# Altium schematic sheet Circuit Schematics_26064.SchDoc
size A3; SheetNumber: 5; SheetTotal: 5
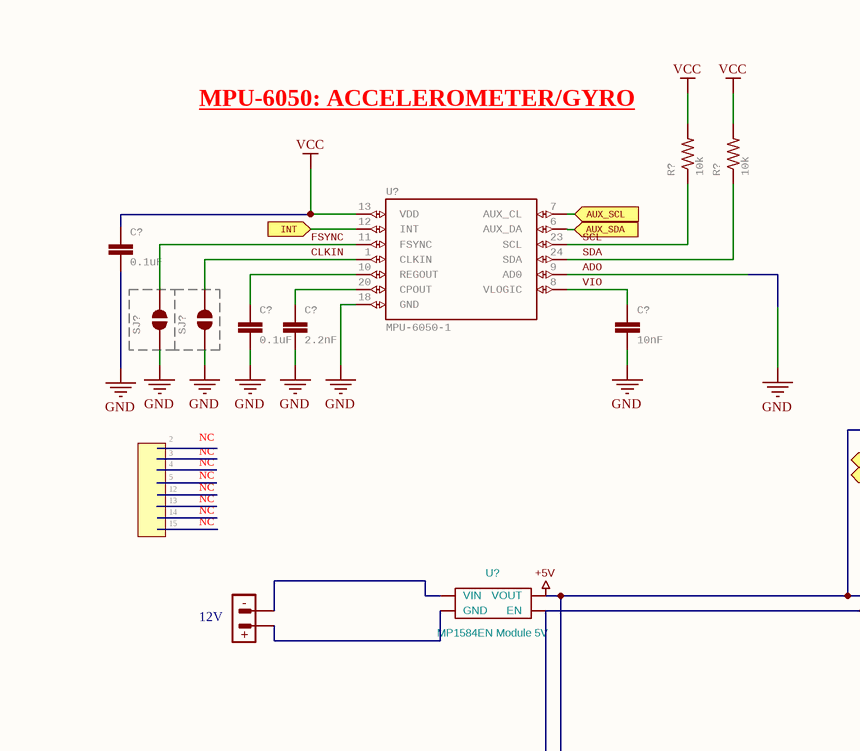
[diagram p0: Circuit Schematics_26064.SchDoc, top left]
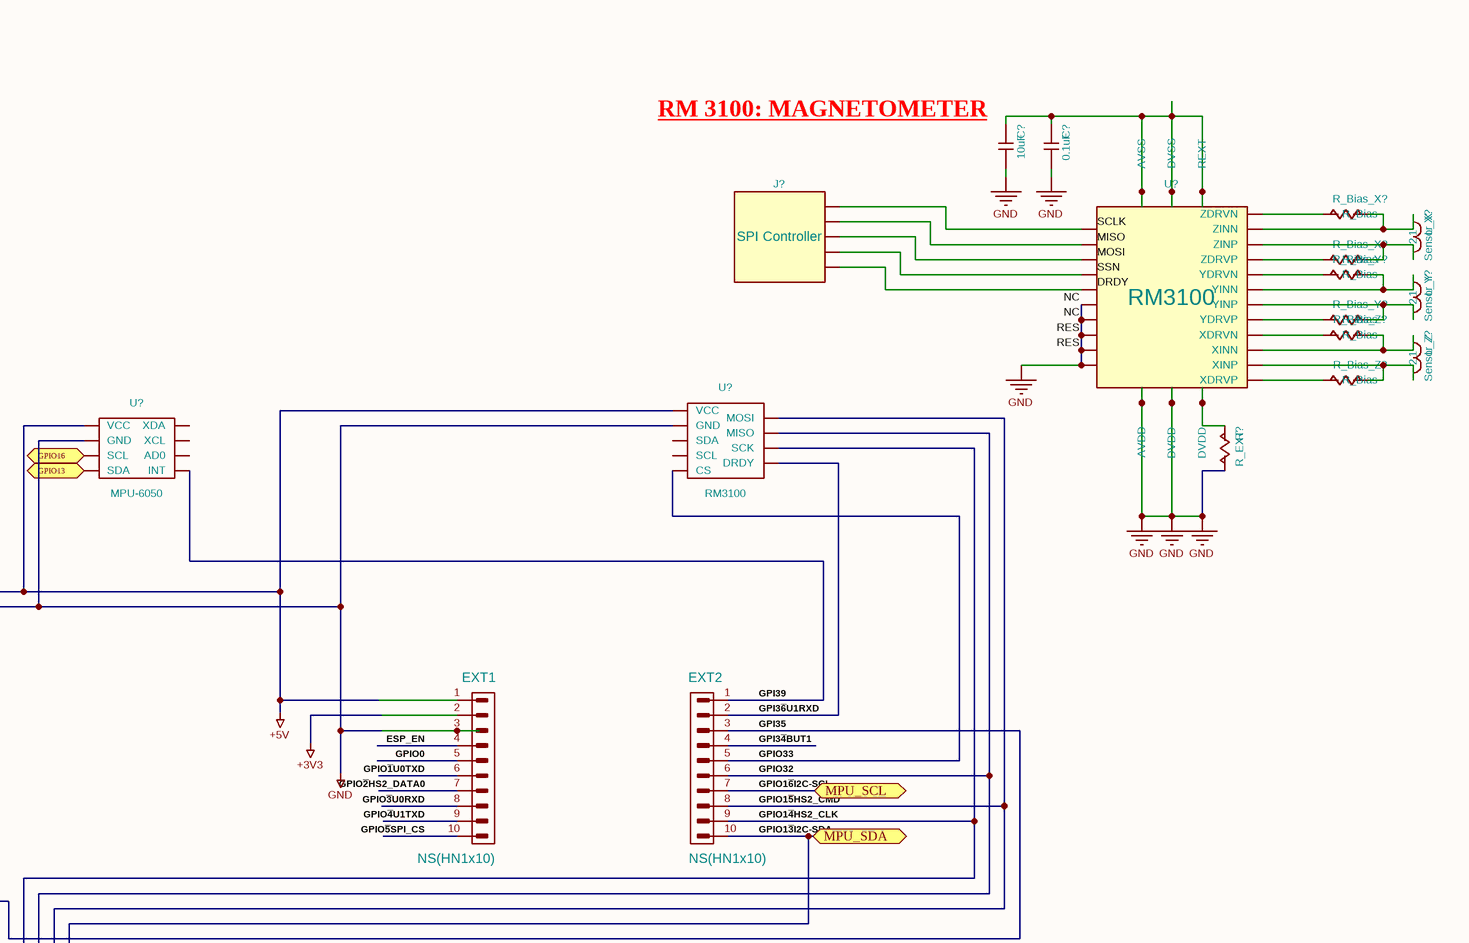
[diagram p1: Circuit Schematics_26064.SchDoc, top right]
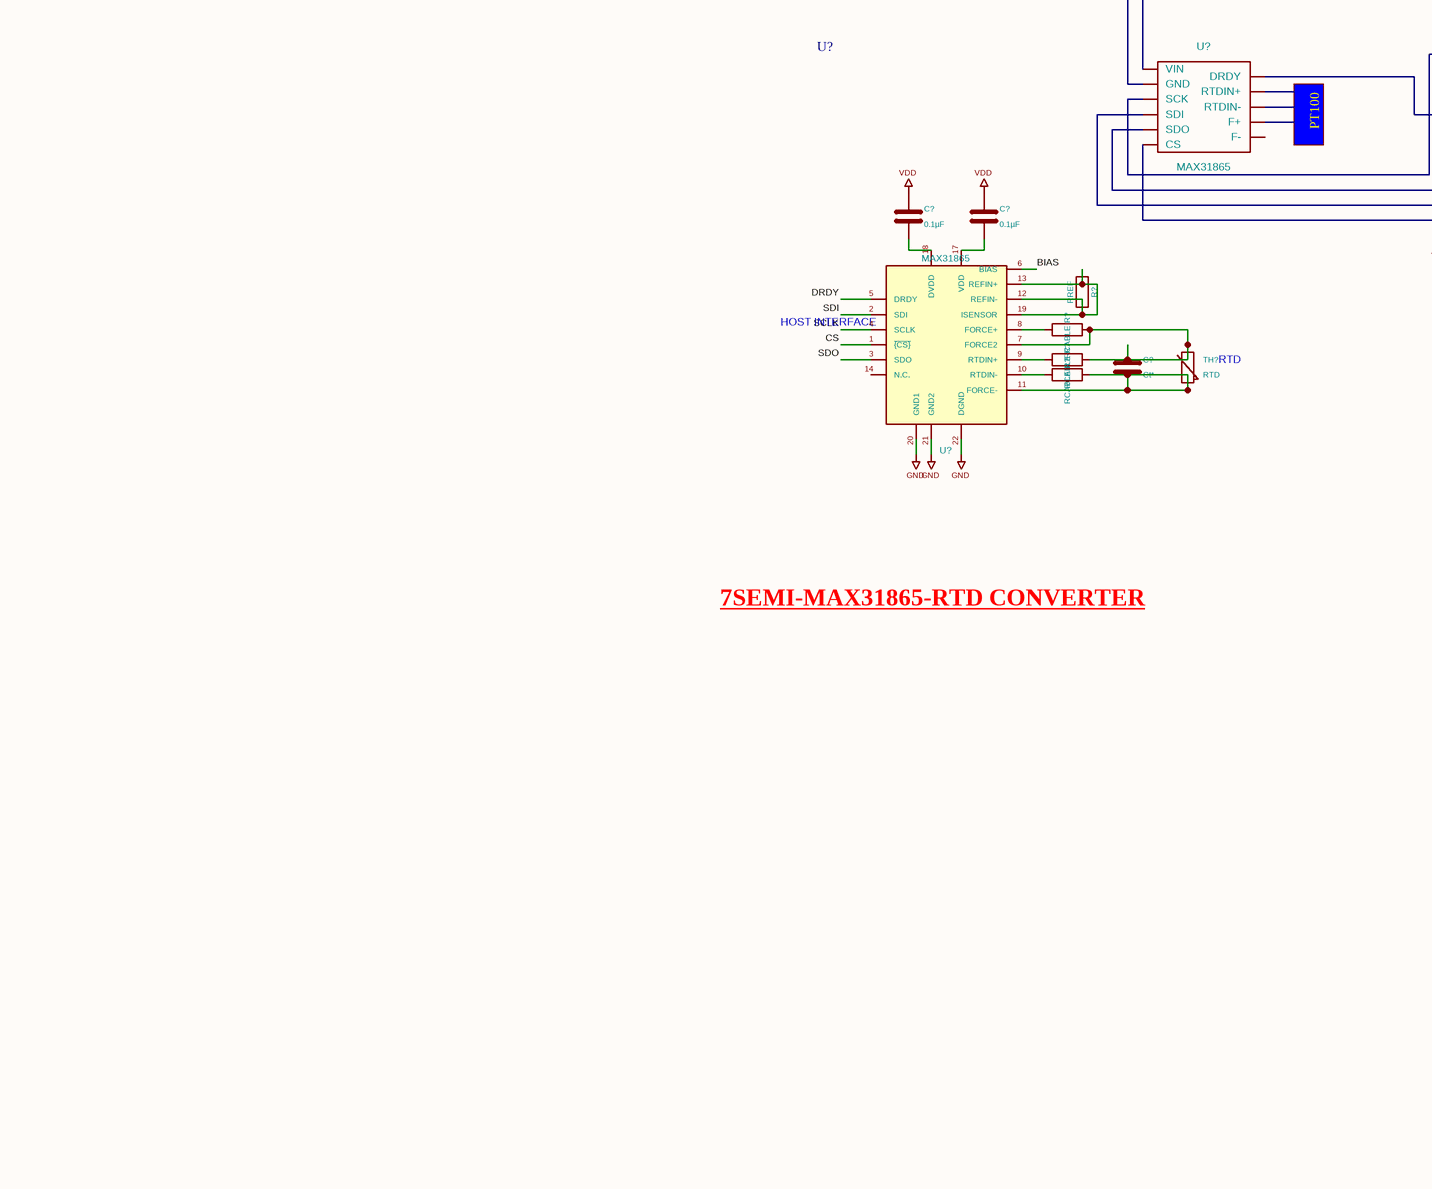
[diagram p2: Circuit Schematics_26064.SchDoc, bottom left]
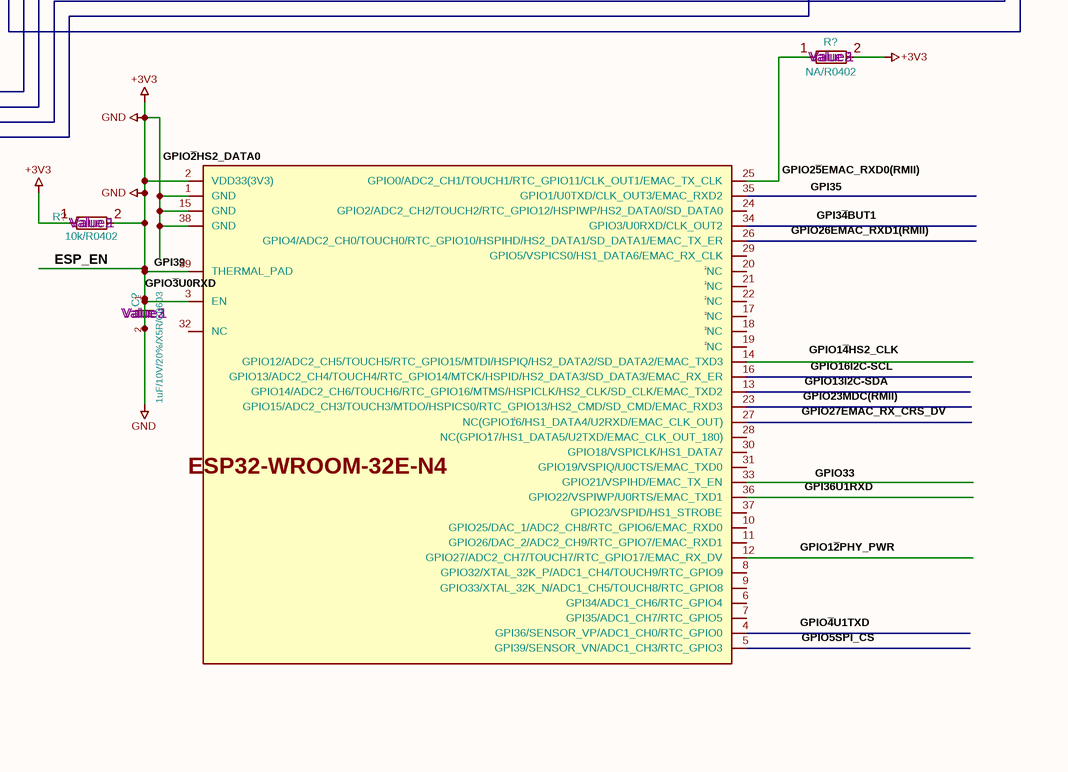
[diagram p3: Circuit Schematics_26064.SchDoc, bottom right]

## Parts
(Parts that share a designator on the sheet are numbered #1, #2 ... from top to bottom, then left to right.)
?  ESP32-WROVER(WROOM)-UNIVERSAL  (value not drawn)
C?#1  10uF
C?#2  0.1uF
C?#3  0.1uF  [0603-CAP]
C?#4  0.1uF  [0603-CAP]
C?#5  2.2nF  [0603-CAP]
C?#6  10nF  [0603-CAP]
C?#7  0.1µF
C?#8  0.1µF
C?#9  Ct*
C?#10  Fieldname 1: Value 1  Fieldname2: Value2  Fieldname3: Value3  [C_0603_5MIL_DWS]  (hidden comment: 1uF/10V/20%/X5R/C0603)
EXT1  NS(HN1x10)  [HN1x10]
EXT2  NS(HN1x10)  [HN1x10]
J?  SPI Controller
L_X?  Sensor_X
L_Y?  Sensor_Y
L_Z?  Sensor_Z
R?#1  10k  [0603-RES]
R?#2  10k  [0603-RES]
R?#3  R_EXT
R?#4  Fieldname 1: Value 1  Fieldname2: Value2  Fieldname3: Value3  [R_0402_5MIL_DWS]  (hidden comment: NA/R0402)
R?#5  RREF
R?#6  Fieldname 1: Value 1  Fieldname2: Value2  [R_0402_5MIL_DWS]  (hidden comment: 10k/R0402)
R?#7  RCABLE
R?#8  RCABLE
R?#9  RCABLE
R_Bias_X?#1  R_Bias
R_Bias_X?#2  R_Bias
R_Bias_Y?#1  R_Bias
R_Bias_Y?#2  R_Bias
R_Bias_Z?#1  R_Bias
R_Bias_Z?#2  R_Bias
SJ?#1  SOLDERJUMPERTRACE  [SJ_2S-TRACE]  (value not drawn)
SJ?#2  SOLDERJUMPERTRACE  [SJ_2S-TRACE]  (value not drawn)
TH?  RTD
U?#1  MPU-6050-1  [QFN-24-4MM2]
U?#2  RM3100
U?#3  RM3100
U?#4  MPU-6050
U?#5  MP1584EN Module 5V
U?#6  BAT_CON  (value not drawn)
U?#7  MAX31865
U?#8  MAX31865

## Ports
AUX_SCL (in), AUX_SDA (in), GPIO13 (bidir), GPIO16 (bidir), INT (in), MPU_SCL (bidir), MPU_SDA (bidir)

## Nets
+5V: EXT1.1 U?#3.1(VCC) U?#4.1(VCC) U?#5.3(VOUT) U?#7.1(VIN)
ADO: ?.1(GND) ?.2(VDD33(3V3)) ?.3(EN) ?.15(GND) ?.38(GND) ?.39(THERMAL_PAD) C?#1.1 C?#2.1 C?#3.2 C?#4.2 C?#5.2 C?#6.2 C?#10.1 C?#10.2 EXT1.2 EXT1.3 EXT1.4 EXT1.8 R?#3.1 R?#4.2 R?#6.1 R?#6.2 SJ?#1.1 SJ?#2.1 U?#1.9(AD0) U?#1.18(GND) U?#2.1(AVDD) U?#2.2(DVDD) U?#2.4(SCLK) U?#2.5(MISO) U?#2.6(MOSI) U?#2.7(SSN) U?#2.8(DRDY) U?#3.2(GND) U?#4.2(GND) U?#5.4(EN) U?#7.2(GND) U?#8.20(GND1) U?#8.21(GND2) U?#8.22(DGND)  [also labelled +3V3, ESP_EN, GND, GPIO~{3}U0RXD, NC, RES]
VCC: C?#3.1 R?#1.2 R?#2.2 U?#1.13(VDD)
VDD: C?#7.1 C?#8.1
AUX_SCL: U?#1.7(AUX_CL) ; port AUX_SCL
AUX_SDA: U?#1.6(AUX_DA) ; port AUX_SDA
BIAS: U?#8.6(BIAS)
CLKIN: SJ?#2.2 U?#1.1(CLKIN)
CS: U?#8.1(~{{CS}})
DRDY: U?#8.5(DRDY)
FSYNC: SJ?#1.2 U?#1.11(FSYNC)
GPI3~{4}BUT1: EXT2.4
GPI35: EXT2.3 U?#7.7(DRDY)
GPI3~{6}U1RXD: EXT2.2 U?#3.9(DRDY)
GPI39: EXT2.1 U?#4.8(INT)
GPIO0: EXT1.5
GPIO~{1}U0TXD: EXT1.6
GPIO~{2}HS2_DATA0: EXT1.7
GPIO~{4}U1TXD: EXT1.9
GPIO~{5}SPI_CS: EXT1.10
GPIO13: U?#4.4(SDA) ; port GPIO13
GPIO1~{3}I2C-SDA: EXT2.10 U?#7.6(CS) ; port MPU_SDA
GPIO1~{4}HS2_CLK: EXT2.9 U?#3.8(SCK) U?#7.3(SCK)
GPIO1~{5}HS2_CMD: EXT2.8 U?#3.6(MOSI) U?#7.4(SDI)
GPIO16: U?#4.3(SCL) ; port GPIO16
GPIO1~{6}I2C-SCL: EXT2.7 ; port MPU_SCL
GPIO32: EXT2.6 U?#3.7(MISO) U?#7.5(SDO)
GPIO33: EXT2.5 U?#3.5(CS)
INT: U?#1.12(INT) ; port INT
SCL: R?#1.1 U?#1.23(SCL)
SCLK: U?#8.4(SCLK)
SDA: R?#2.1 U?#1.24(SDA)
SDI: U?#8.2(SDI)
SDO: U?#8.3(SDO)
VIO: C?#6.1 U?#1.8(VLOGIC)
Net?_25: ?.25(GPIO0/ADC2_CH1/TOUCH1/RTC_GPIO11/CLK_OUT1/EMAC_TX_CLK) R?#4.1
NetC?#1_2: C?#1.2 C?#2.2 U?#2.14(AVSS) U?#2.15(DVSS) U?#2.16(REXT)
NetC?#4_1: C?#4.1 U?#1.10(REGOUT)
NetC?#5_1: C?#5.1 U?#1.20(CPOUT)
NetC?#7_2: C?#7.2 U?#8.18(DVDD)
NetC?#8_2: C?#8.2 U?#8.17(VDD)
NetC?#9_1: C?#9.1 R?#7.2 R?#8.2 TH?.1 U?#8.7(FORCE2)
NetC?#9_2: C?#9.2 R?#9.2 TH?.2 U?#8.11(FORCE-)
NetJ?_1: J?.1(SCLK) U?#2.9(NC)
NetJ?_2: J?.2(MISO) U?#2.10(NC)
NetJ?_3: J?.3(MOSI) U?#2.11(RES)
NetJ?_4: J?.4(SSN/CS) U?#2.12(RES)
NetJ?_5: J?.5(DRDY) U?#2.13(I2C)
NetL_X?_1: L_X?.1 R_Bias_X?#2.2 U?#2.26(ZINP)
NetL_X?_2: L_X?.2 R_Bias_X?#1.2 U?#2.27(ZINN)
NetL_Y?_1: L_Y?.1 R_Bias_Y?#2.2 U?#2.22(YINP)
NetL_Y?_2: L_Y?.2 R_Bias_Y?#1.2 U?#2.23(YINN)
NetL_Z?_1: L_Z?.1 R_Bias_Z?#2.2 U?#2.18(XINP)
NetL_Z?_2: L_Z?.2 R_Bias_Z?#1.2 U?#2.19(XINN)
NetR?#3_2: R?#3.2 U?#2.3(DVDD)
NetR?#5_1: R?#5.1 R?#5.2 U?#8.12(REFIN-) U?#8.13(REFIN+) U?#8.19(ISENSOR)
NetR?#7_1: R?#7.1 U?#8.8(FORCE+)
NetR?#8_1: R?#8.1 U?#8.9(RTDIN+)
NetR?#9_1: R?#9.1 U?#8.10(RTDIN-)
NetR_Bias_X?#1_1: R_Bias_X?#1.1 U?#2.28(ZDRVN)
NetR_Bias_X?#2_1: R_Bias_X?#2.1 U?#2.25(ZDRVP)
NetR_Bias_Y?#1_1: R_Bias_Y?#1.1 U?#2.24(YDRVN)
NetR_Bias_Y?#2_1: R_Bias_Y?#2.1 U?#2.21(YDRVP)
NetR_Bias_Z?#1_1: R_Bias_Z?#1.1 U?#2.20(XDRVN)
NetR_Bias_Z?#2_1: R_Bias_Z?#2.1 U?#2.17(XDRVP)
NetU?#5_1: U?#5.1(VIN) U?#6.2
NetU?#5_2: U?#5.2(GND) U?#6.1

Not connected (* = marked no-connect by the designer): ? 4(GPI36/SENSOR_VP/ADC1_CH0/RTC_GPIO0) 5(GPI39/SENSOR_VN/ADC1_CH3/RTC_GPIO3) 6(GPI34/ADC1_CH6/RTC_GPIO4) 7(GPI35/ADC1_CH7/RTC_GPIO5) 8(GPIO32/XTAL_32K_P/ADC1_CH4/TOUCH9/RTC_GPIO9) 9(GPIO33/XTAL_32K_N/ADC1_CH5/TOUCH8/RTC_GPIO8) 10(GPIO25/DAC_1/ADC2_CH8/RTC_GPIO6/EMAC_RXD0) 11(GPIO26/DAC_2/ADC2_CH9/RTC_GPIO7/EMAC_RXD1) 12(GPIO27/ADC2_CH7/TOUCH7/RTC_GPIO17/EMAC_RX_DV) 13(GPIO14/ADC2_CH6/TOUCH6/RTC_GPIO16/MTMS/HSPICLK/HS2_CLK/SD_CLK/EMAC_TXD2) 14(GPIO12/ADC2_CH5/TOUCH5/RTC_GPIO15/MTDI/HSPIQ/HS2_DATA2/SD_DATA2/EMAC_TXD3) 16(GPIO13/ADC2_CH4/TOUCH4/RTC_GPIO14/MTCK/HSPID/HS2_DATA3/SD_DATA3/EMAC_RX_ER) 17(NC) 18(NC) 19(NC) 20(NC) 21(NC) 22(NC) 23(GPIO15/ADC2_CH3/TOUCH3/MTDO/HSPICS0/RTC_GPIO13/HS2_CMD/SD_CMD/EMAC_RXD3) 24(GPIO2/ADC2_CH2/TOUCH2/RTC_GPIO12/HSPIWP/HS2_DATA0/SD_DATA0) 26(GPIO4/ADC2_CH0/TOUCH0/RTC_GPIO10/HSPIHD/HS2_DATA1/SD_DATA1/EMAC_TX_ER) 27(NC(GPIO16/HS1_DATA4/U2RXD/EMAC_CLK_OUT)) 28(NC(GPIO17/HS1_DATA5/U2TXD/EMAC_CLK_OUT_180)) 29(GPIO5/VSPICS0/HS1_DATA6/EMAC_RX_CLK) 30(GPIO18/VSPICLK/HS1_DATA7) 31(GPIO19/VSPIQ/U0CTS/EMAC_TXD0) 32(NC) 33(GPIO21/VSPIHD/EMAC_TX_EN) 34(GPIO3/U0RXD/CLK_OUT2) 35(GPIO1/U0TXD/CLK_OUT3/EMAC_RXD2) 36(GPIO22/VSPIWP/U0RTS/EMAC_TXD1) 37(GPIO23/VSPID/HS1_STROBE); U?#3 3(SDA) 4(SCL); U?#4 5(XDA) 6(XCL) 7(AD0); U?#7 8(RTDIN+) 9(RTDIN-) 10(F+) 11(F-); U?#8 14(N.C.)

## Notes on the sheet
- MPU-6050: ACCELEROMETER/GYRO
- RM 3100: MAGNETOMETER
- 2
- NC
- 3
- 4
- 5
- 12
- 13
- 14
- 15
- (near U?#6) 12V
- (near U?#7) PT100
- (near U?#8) HOST
  INTERFACE
- (near TH?) RTD
- 7SEMI-MAX31865-RTD CONVERTER
- Labels drawn without touching a wire or pin: DRDY, GPI3~{4}BUT1, GPI3~{6}U1RXD, GPI35, GPI39, GPIO1~{2}PHY_PWR, GPIO1~{3}I2C-SDA, GPIO1~{4}HS2_CLK, GPIO1~{6}I2C-SCL, GPIO2~{3}MDC(RMII), GPIO2~{5}EMAC_RXD0(RMII), GPIO2~{6}EMAC_RXD1(RMII), GPIO2~{7}EMAC_RX_CRS_DV, GPIO33, GPIO~{2}HS2_DATA0, GPIO~{4}U1TXD, GPIO~{5}SPI_CS, MISO, MOSI, SCLK, SSN
- (in symbol BAT_CON) -; +
- (in symbol ESP32-WROVER(WROOM)-UNIVERSAL) 2.; 1.; ESP32-WROOM-32E-N4

## Library data of the parts
C?#1 C?#2 C?#7-C?#10 = C
  C?#1: Value: 10uF
  C?#2: Value: 0.1uF
  C?#7 C?#8: Value: 0.1µF
  C?#9: Value: Ct*
  C?#10: Value: 1uF/10V/20%/X5R/C0603
C?#3-C?#6 = CAP0603-CAP: CapacitorStandard 0603 ceramic capacitor, and 0.1" leaded capacitor.; GateName_1: G$1; SymbolName_1: CAP; DeviceName: 0603-CAP; LibraryName: SparkFun; DeviceSetName: CAP
EXT1 EXT2 = CON10: Value: NS(HN1x10)
J? = SPI_Controller: Value: SPI Controller
L_X? L_Y? L_Z? = L
  L_X?: Value: Sensor_X
  L_Y?: Value: Sensor_Y
  L_Z?: Value: Sensor_Z
R?#1 R?#2 = RESISTOR0603-RES: ResistorBasic schematic elements and footprints for 0603, 1206, and PTH resistors.; GateName_1: G$1; SymbolName_1: RESISTOR; DeviceName: 0603-RES; LibraryName: SparkFun; DeviceSetName: RESISTOR
R?#3-R?#9 R_Bias_X?#1 R_Bias_X?#2 R_Bias_Y?#1 R_Bias_Y?#2 R_Bias_Z?#1 R_Bias_Z?#2 = R
  R?#3: Value: R_EXT
  R?#4: Value: NA/R0402
  R?#5: Value: RREF
  R?#6: Value: 10k/R0402
  R?#7-R?#9: Value: RCABLE
  R_Bias_X?#1 R_Bias_X?#2 R_Bias_Y?#1 R_Bias_Y?#2 R_Bias_Z?#1 R_Bias_Z?#2: Value: R_Bias
SJ?#1 SJ?#2 = SOLDERJUMPERTRACE: Solder JumperStandard SMD solder jumper. Used to automate production. Two varients : Normally Open and Normally Closed are the same, but have different paste layers. NC will have a large amount of paste and should jumper during reflow.; GateName_1: 1; SymbolName_1: SJ; DeviceName: TRACE; LibraryName: SparkFun; DeviceSetName: SOLDERJUMPER
TH? = Thermistor: Value: RTD
U?#1 = MPU-6050-1: GateName_1: G$1; DeviceName: -1; SymbolName_1: MPU-6050; LibraryName: Testing; DeviceSetName: MPU-6050
U?#3 = module_U1: Value: RM3100
U?#4 = module_U3: Value: MPU-6050
U?#5 = module_U4: Value: MP1584EN Module 5V
U?#7 = module_U2: Value: MAX31865
U?#2 = RM3100: Value: RM3100
U?#8 = MAX31865: Value: MAX31865